# EAGLE design coffee_roaster (EAGLE 7.7.0)
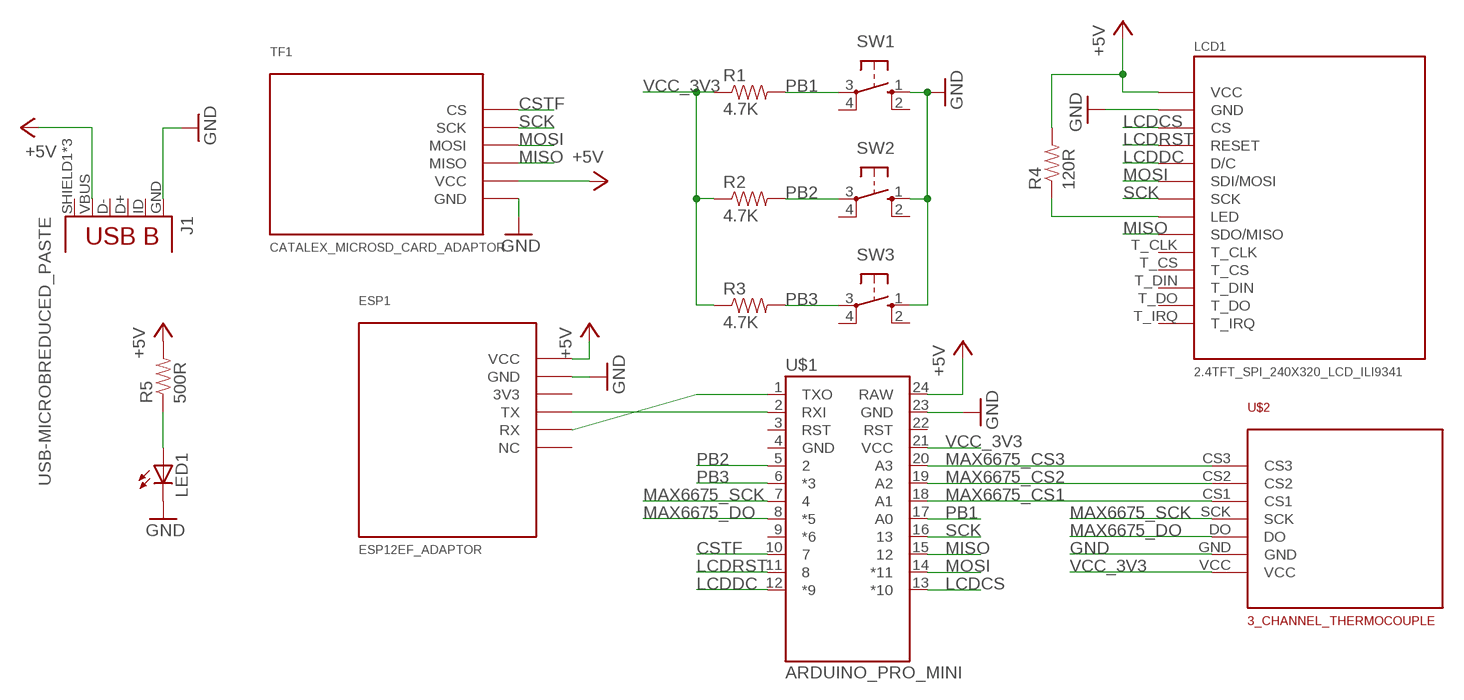
[diagram p0: schematic, sheet 1]

## Parts
ESP1  ESP12EF_ADAPTOR  [ESP12EF_ADAPTOR]
J1  USB-MICROBREDUCED_PASTE  [USB-B-MICRO-SMD_V03_RED_PASTE]
LCD1  2.4TFT_SPI_240X320_LCD_ILI9341  [2.4TFT_SPI_240X320_LCD_ILI9341]
LED1  LED5MM  [LED5MM]
R1  4.7K  10KOHM-1/10W-1%(0603)0603  [0603-RES]
R2  4.7K  10KOHM-1/10W-1%(0603)0603  [0603-RES]
R3  4.7K  10KOHM-1/10W-1%(0603)0603  [0603-RES]
R4  120R  10KOHM-1/10W-1%(0603)0603  [0603-RES]
R5  500R  10KOHM-1/10W-1%(0603)0603  [0603-RES]
SW1  PUSHBUTTON  [B3F-10XX]
SW2  PUSHBUTTON  [B3F-10XX]
SW3  PUSHBUTTON  [B3F-10XX]
TF1  CATALEX_MICROSD_CARD_ADAPTOR  [CATALEX_MICROSD_CARD_ADAPTOR]
U$1  ARDUINO_PRO_MINI  [ARDUINO_PRO_MINI]
U$2  3_CHANNEL_THERMOCOUPLE  [3_CHANNEL_THERMOCOUPLE]

## Nets
+5V: ESP1.VCC J1.VBUS LCD1.VCC R4.2 R5.2 TF1.VCC U$1.24(RAW)
CSTF: TF1.CS U$1.10
GND: ESP1.GND J1.GND LCD1.GND LED1.K(C) SW1.1(S) SW2.1(S) SW3.1(S) TF1.GND U$1.23(GND) U$2.GND
LCDCS: LCD1.CS U$1.13(*10)
LCDDC: LCD1.D/C U$1.12(*9)
LCDRST: LCD1.RESET U$1.11
MAX6675_CS1: U$1.18(A1) U$2.CS1
MAX6675_CS2: U$1.19(A2) U$2.CS2
MAX6675_CS3: U$1.20(A3) U$2.CS3
MAX6675_DO: U$1.8(*5) U$2.DO
MAX6675_SCK: U$1.7 U$2.SCK
MISO: LCD1.SDO/MISO TF1.MISO U$1.15
MOSI: LCD1.SDI/MOSI TF1.MOSI U$1.14(*11)
N$1: LCD1.LED R4.1
N$3: LED1.A R5.1
N$5: ESP1.RX U$1.1(TXO)
N$18: ESP1.TX U$1.2(RXI)
PB1: R1.2 SW1.3(P) U$1.17(A0)
PB2: R2.2 SW2.3(P) U$1.5
PB3: R3.2 SW3.3(P) U$1.6(*3)
SCK: LCD1.SCK TF1.SCK U$1.16
VCC_3V3: R1.1 R2.1 R3.1 U$1.21(VCC) U$2.VCC
Unconnected: ESP1.3V3 ESP1.NC J1.D+ J1.D- J1.ID(USBID) J1.SHIELD1(SHIELD) J1.SHIELD2(SHIELD) J1.SHIELD3(SHIELD) LCD1.T_CLK LCD1.T_CS LCD1.T_DIN LCD1.T_DO LCD1.T_IRQ SW1.2(S1) SW1.4(P1) SW2.2(S1) SW2.4(P1) SW3.2(S1) SW3.4(P1) U$1.3(RST) U$1.4(GND) U$1.9(*6) U$1.22(RST)

## Library data of the parts
ESP1 = coffee_roaster:ESP12EF_ADAPTOR: ESP-12E/F Adaptor designed by IFFPC.
J1 = coffee_roaster:USB-MICROB: RED_PASTE version has 70% paste area under D+ D- USBID pins for applications where those pins aren't required, to reduce the likelihood of bridges.; PROD_ID: CONN-11752
LCD1 = coffee_roaster:2.4TFT_SPI_240X320_LCD_ILI9341: 2.2 inch 240x320 TFT LCD Module with SPI Interface.
LED1 = coffee_roaster:LED: LED OSRAM: - CHIPLED LG R971, LG N971, LY N971, LG Q971, LY Q971, LO R971, LY R971 LH N974, LH R974 LS Q976, LO Q976, LY Q976 LO Q996 - Hyper CHIPLED LW Q18S LB Q993, LB Q99A, LB R99A - SideLED LS A670, LO A670, LY A670, LG A670, LP A670 LB A673, LV A673, LT A673, LW A673 LH A674 LY A675 LS A676, LA A676, LO A676, LY A676, LW A676 LS A679, LY A679, LG A679 - Hyper Micro SIDELED® LS Y876, LA Y876, LO Y876, LY Y876 LT Y87S - SmartLED LW L88C, LW L88S LB L89C, LB L89S, LG L890 LS L89K, LO L89K, LY L89K LS L896, LA L896, LO L896, LY L896 - TOPLED LS T670, LO T670, LY T670, LG T670, LP T670 LSG T670, LSP T670, LSY T670, LOP T670, LYG T670 LG T671, LOG T671, LSG T671 LB T673, LV T673, LT T673, LW T673 LH T674 LS T676, LA T676, LO T676, LY T676, LB T676, LH T676, LSB T676, LW T676 LB T67C, LV T67C, LT T67C, LS T67K, LO T67K, LY T67K, LW E67C LS E67B, LA E67B, LO E67B, LY E67B, LB E67C, LV E67C, LT E67C LW T67C LS T679, LY T679, LG T679 LS T770, LO T770, LY T770, LG T770, LP T770 LB T773, LV T773, LT T773, LW T773 LH T774 LS E675, LA E675, LY E675, LS T675 LS T776, LA T776, LO T776, LY T776, LB T776 LHGB T686 LT T68C, LB T68C - Hyper Mini TOPLED® LB M676 - Mini TOPLED Santana® LG M470 LS M47K, LO M47K, LY M47K Source: http://www.osram.convergy.de/
R1-R5 = coffee_roaster:10KOHM-1/10W-1%(0603): RES-00824; PROD_ID: RES-00824; VALUE: 10K
SW1-SW3 = coffee_roaster:PUSHBUTTON: OMRON SWITCH
TF1 = coffee_roaster:CATALEX_MICROSD_CARD_ADAPTOR
U$1 = coffee_roaster:ARDUINO_PRO_MINI
U$2 = coffee_roaster:3_CHANNEL_THERMOCOUPLE

## Net classes
0 default: width 0.305 mm

## Board
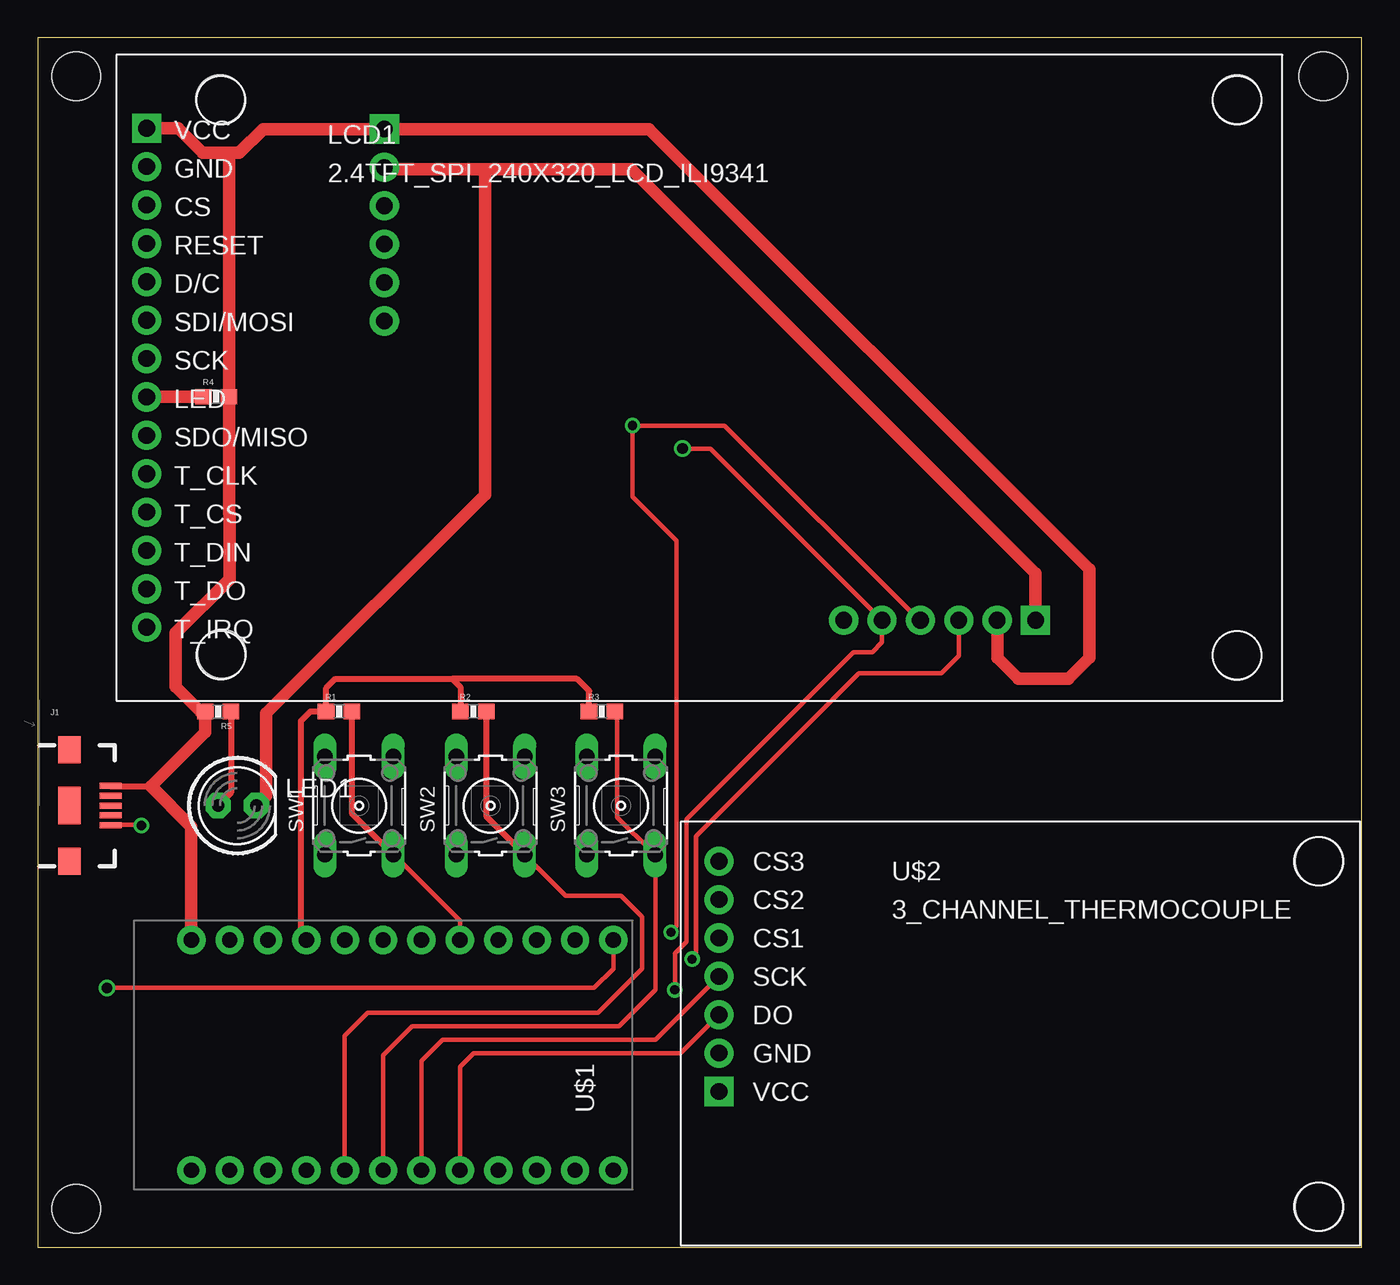
[diagram p1: board, top side]
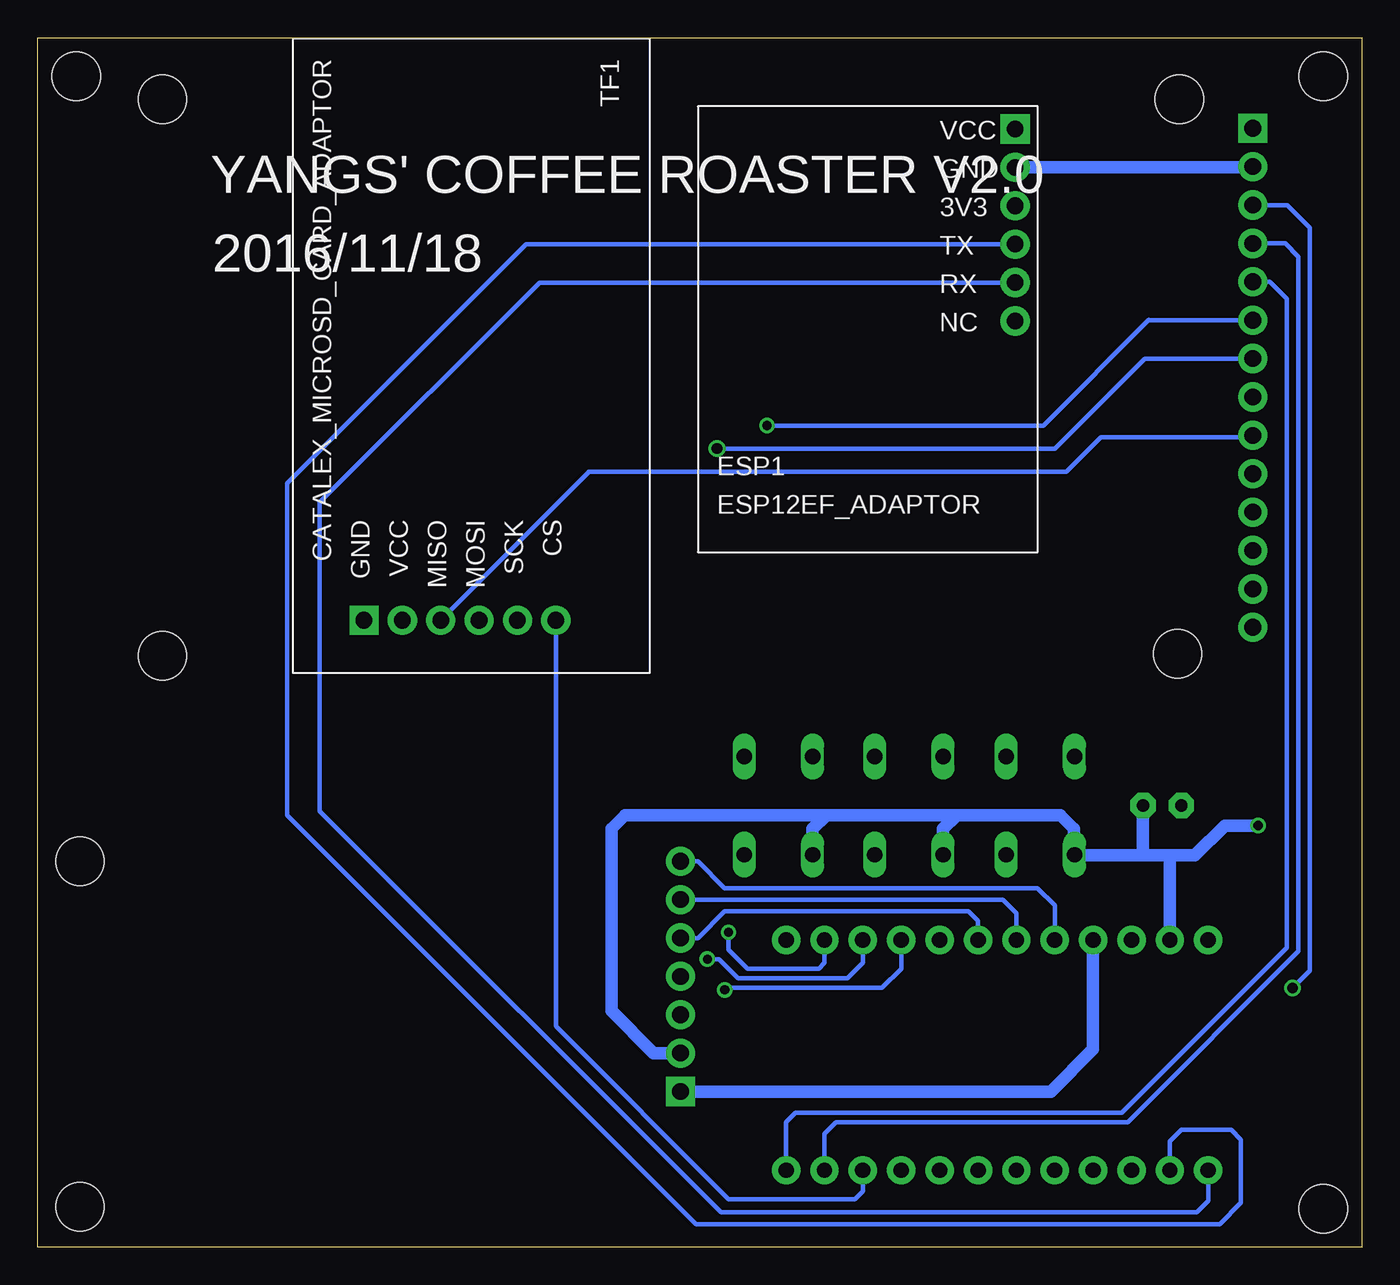
[diagram p2: board, bottom side, seen from below]

Size 87.63 x 80.01 mm. Coordinates in mm from the lower left corner, seen from the top.
Outline: 0,0 87.63,0 87.63,80.01 0,80.01 0,0
Copper layers (1*16): Top 0.035mm / dielectric 1.5mm / Bottom 0.035mm
Design rules "default": minimum track width 10mil, minimum drill 24mil, track to track 8mil, track to pad 8mil, pad to pad 8mil, via to via 8mil, smd to smd 8mil, copper to edge 40mil, drill to drill 8mil, minimum pad ring 10mil, minimum via ring 8mil, stop-mask expansion 4mil, vias tented up to drill 0mil, thermal gap 10mil
Holes 3.2 mm at 2.54,2.54 2.54,77.47 79.38,75.95 84.84,2.67 12.06,75.95 12.19,39.24 79.38,39.12 85.09,77.47 84.84,25.53

### Footprints (pad centres in the part's own frame; a part is rotated, then mirrored left to right if it is on the bottom)
ESP12EF_ADAPTOR = drill 1.1 pad 1.93: 3V3 21,22.92; GND 21,25.46; NC 21,15.3; RX 21,17.84; TX 21,20.38 | drill 1.1 pad 1.93 square: VCC 21,28
USB-B-MICRO-SMD_V03_RED_PASTE = smd 1.45 x 0.4: D+ 2.725,0; D- 2.725,0.65; GND 2.725,-1.3; ID 2.725,-0.65; VBUS 2.725,1.3 | smd 1.5 x 1.8: SHIELD1 0,3.685; SHIELD2 0,-3.685 | smd 1.5 x 2.5: SHIELD3 0,0
2.4TFT_SPI_240X320_LCD_ILI9341 = drill 1.1 pad 1.93: CS 2,32.79; D/C 2,27.71; GND 2,35.33; LED 2,20.09; RESET 2,30.25; SCK 2,22.63; SDI/MOSI 2,25.17; SDO/MISO 2,17.55; T_CLK 2,15.01; T_CS 2,12.47; T_DIN 2,9.93; T_DO 2,7.39; T_IRQ 2,4.85 | drill 1.1 pad 1.93 square: VCC 2,37.87
LED5MM = drill 0.813 pad 1.676 octagon: A -1.27,0; K 1.27,0
0603-RES = smd 1.1 x 1: 1 -0.85,0; 2 0.85,0
B3F-10XX = drill 1.016 long: 1 -3.251,2.261; 2 3.251,2.261; 3 -3.251,-2.261; 4 3.251,-2.261
CATALEX_MICROSD_CARD_ADAPTOR = drill 1.1 pad 1.93: CS -3.5,17.4; MISO -3.5,9.78; MOSI -3.5,12.32; SCK -3.5,14.86; VCC -3.5,7.24 | drill 1.1 pad 1.93 square: GND -3.5,4.7
ARDUINO_PRO_MINI = drill 1.016 pad 1.88: 1 -7.62,12.7; 2 -7.62,10.16; 3 -7.62,7.62; 4 -7.62,5.08; 5 -7.62,2.54; 6 -7.62,0; 7 -7.62,-2.54; 8 -7.62,-5.08; 9 -7.62,-7.62; 10 -7.62,-10.16; 11 -7.62,-12.7; 12 -7.62,-15.24; 13 7.62,-15.24; 14 7.62,-12.7; 15 7.62,-10.16; 16 7.62,-7.62; 17 7.62,-5.08; 18 7.62,-2.54; 19 7.62,0; 20 7.62,2.54; 21 7.62,5.08; 22 7.62,7.62; 23 7.62,10.16; 24 7.62,12.7
3_CHANNEL_THERMOCOUPLE = drill 1.1 pad 1.93: CS1 2.54,20.32; CS2 2.54,22.86; CS3 2.54,25.4; DO 2.54,15.24; GND 2.54,12.7; SCK 2.54,17.78 | drill 1.1 pad 1.93 square: VCC 2.54,10.16

### Placement (x,y rotation side)
ESP1  43.94,45.97 0 bottom
J1  2.1,29.21 0 top
LCD1  5.21,36.15 0 top
LED1  13.21,29.21 0 top
R1  19.94,35.43 0 top
R2  28.83,35.43 0 top
R3  37.34,35.43 0 top
R4  11.81,56.26 0 top
R5  11.94,35.43 180 top
SW1  21.27,29.21 90 top
SW2  29.97,29.21 90 top
SW3  38.61,29.21 90 top
TF1  70.74,37.97 270 bottom
U$1  22.86,12.7 90 top
U$2  42.55,0.13 0 top

### Tracks (layer width: path | path; a pad name or v marks a point on that pad's centre or on a via)
+5V
  Top 0.406: J1.VBUS 4.85,30.48 7.49,30.48
  Top 0.813: ESP1.VCC 40.45,73.97 69.6,44.83 69.6,38.99 68.2,37.59 64.9,37.59 63.5,38.99 TF1.VCC | U$1.24 10.16,27.81 7.49,30.48 11.09,34.08 R5.2 10.79,35.43 9.14,37.08 9.14,40.64 12.7,44.2 12.7,48.51 12.66,48.55 R4.2 12.66,72.39 | ESP1.VCC 22.89,74.02 | LCD1.VCC 9.29,74.02 10.92,72.39 12.66,72.39 | 12.66,72.39 13.34,72.39 14.92,73.97 ESP1.VCC
  Top 1.016: 22.94,74.02 ESP1.VCC
CSTF
  Bottom 0.305: U$1.10 33.02,3.68 33.53,3.17 41.91,3.17 53.34,14.6 TF1.CS
GND  (via drill 0.61)
  Top 0.305: J1.GND 5.08,27.94 6.99,27.94 v6.86,27.89
  Top 0.406: 23.16,71.32 ESP1.GND
  Top 0.813: 23.09,71.32 23.16,71.32 29.59,71.32 | 29.59,71.32 39.29,71.32 66.04,44.58 TF1.GND | 29.59,71.32 29.59,49.78 15.11,35.31 15.11,29.84 LED1.K
  Bottom 0.406: 14.48,26.21 14.63,26.21 14.63,25.91
  Bottom 0.813: 26.8,28.57 19.94,28.57 19.05,27.69 19.05,26 SW1.1 18.96,25.91 14.63,25.91 12.95,25.91 | 26.8,28.57 27.71,27.66 SW2.1 | SW3.1 36.35,27.66 35.43,28.57 | 35.43,28.57 26.8,28.57 | U$2.GND 46.86,12.83 49.66,15.62 49.66,27.69 48.77,28.57 35.43,28.57 | U$1.23 12.7,25.65 12.95,25.91 | LED1.K 14.48,26.21 14.48,25.91 arc-90 14.57,26 | 12.95,25.91 11.05,25.91 9.07,27.89 v6.86,27.89 | ESP1.GND 7.26,71.43 LCD1.GND
LCDCS  (via drill 0.7)
  Top 0.305: v4.57,17.14 36.83,17.14 38.1,18.41 U$1.13
  Bottom 0.305: v4.57,17.14 3.43,18.29 3.43,67.44 4.94,68.94 LCD1.CS
LCDDC
  Bottom 0.305: U$1.12 38.1,8.26 37.47,8.89 15.88,8.89 4.95,19.81 4.95,62.74 6.08,63.86 LCD1.D/C
LCDRST
  Bottom 0.305: U$1.11 35.56,7.49 34.8,8.26 15.49,8.26 4.19,19.56 4.19,65.53 5.06,66.4 LCD1.RESET
MAX6675_CS1
  Bottom 0.305: U$1.18 25.4,21.59 26.04,22.23 42.16,22.23 43.94,20.45 U$2.CS1
MAX6675_CS2
  Bottom 0.305: U$1.19 22.86,22.1 23.75,22.99 U$2.CS2
MAX6675_CS3
  Bottom 0.305: U$1.20 20.32,22.61 21.46,23.75 42.16,23.75 43.94,25.53 U$2.CS3
MAX6675_DO
  Top 0.305: U$1.8 27.94,11.94 28.83,12.83 42.55,12.83 U$2.DO
MAX6675_SCK
  Top 0.305: U$1.7 25.4,12.32 26.8,13.72 40.89,13.72 U$2.SCK
MISO  (via drill 0.61)
  Top 0.305: v43.31,19.05 43.43,19.05 arc90 43.56,19.18 43.56,27.18 54.36,37.97 59.82,37.97 60.96,39.12 TF1.MISO
  Bottom 0.305: 33.02,19.94 U$1.15 33.02,18.8 34.04,17.78 41.27,17.78 42.55,19.05 v43.31,19.05 | TF1.MISO 51.18,51.25 51.18,51.31 19.56,51.31 17.27,53.59 7.37,53.59 LCD1.SDO/MISO
MOSI  (via drill 0.61)
  Top 0.305: TF1.MOSI 58.17,41.66 45.47,54.36 v39.37,54.36 39.37,49.66 42.29,46.74 42.29,21.21 v41.91,20.83
  Bottom 0.305: v39.37,54.36 21.08,54.36 14.1,61.34 14.1,61.32 LCD1.SDI/MOSI | U$1.14 35.56,18.8 35.94,18.41 40.64,18.41 41.91,19.68 v41.91,20.83
N$1
  Top 0.813: R4.1 10.96,56.24 LCD1.LED
N$3
  Top 0.406: R5.1 12.79,30.06 LED1.A
N$5
  Bottom 0.305: ESP1.RX 54.42,63.81 68.96,49.28 68.96,28.83 42.42,2.29 10.92,2.29 10.16,3.05 U$1.1
N$18
  Bottom 0.305: ESP1.TX 55.31,66.35 71.12,50.55 71.12,28.57 44.07,1.52 9.4,1.52 8,2.92 8,7.11 8.64,7.75 11.94,7.75 12.7,6.99 U$1.2
PB1
  Top 0.305: U$1.17 27.94,21.59 23.62,25.91 SW1.3
  Top 0.406: R1.2 20.79,28.7 SW1.3
PB2
  Top 0.305: SW2.3 32.26,25.91 34.92,23.24 38.61,23.24 40.01,21.84 40.01,18.41 37.08,15.49 21.84,15.49 20.32,13.97 U$1.5
  Top 0.406: R2.2 29.68,28.51 SW2.3
PB3
  Top 0.305: R3.2 38.35,35.31 38.35,28.45 40.64,26.16 SW3.3 40.89,25.96 40.89,17.02 38.48,14.61 24.77,14.61 22.86,12.7 U$1.6
SCK  (via drill 0.61, 0.7)
  Top 0.305: v42.67,52.83 44.52,52.83 TF1.SCK 55.88,40 55.24,39.37 53.98,39.37 42.93,28.32 42.93,20.19 42.16,19.43 v42.16,17.02
  Bottom 0.305: U$1.16 30.48,18.41 31.75,17.14 41.91,17.14 v42.16,17.02 | LCD1.SCK 14.37,58.78 20.32,52.83 v42.67,52.83
VCC_3V3
  Top 0.406: 27.43,37.59 19.68,37.59 19.09,37 R1.1 18.03,35.43 17.4,34.8 17.4,20.7 U$1.21 | 27.43,37.59 27.98,37.05 R2.1 | R3.1 36.49,36.79 35.69,37.59 27.43,37.59
  Bottom 0.813: U$2.VCC 20.57,10.29 17.78,13.08 U$1.21

### Text on the board
bPlace: YANGS' COFFEE ROASTER V2.0 | 2016/11/18